# Altium schematic sheet ROCKCHIP_GPIO_NC PINS.SchDoc
size A4; SheetNumber: 26; SheetTotal: 27
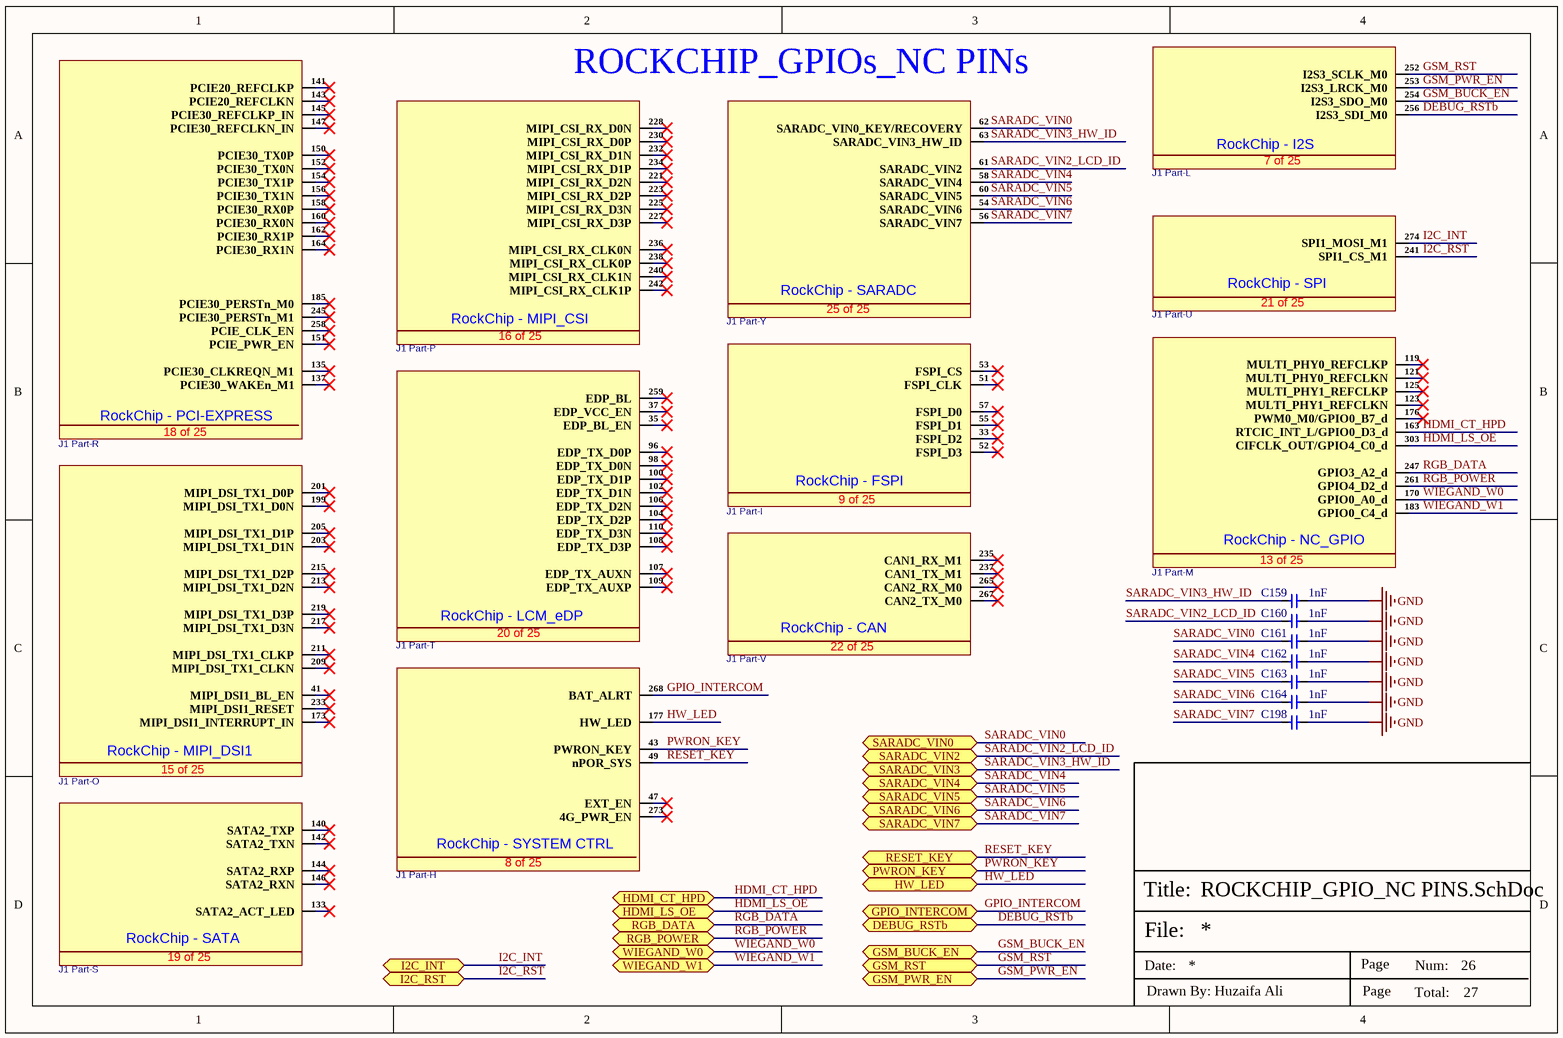
[diagram p0: ROCKCHIP_GPIO_NC PINS.SchDoc]

## Parts
C159  1nF  [Cap-0402]
C160  1nF  [Cap-0402]
C161  1nF  [Cap-0402]
C162  1nF  [Cap-0402]
C163  1nF  [Cap-0402]
C164  1nF  [Cap-0402]
C198  1nF  [Cap-0402]
J1_Part-  AS0B826-S78B-7H  [AS0B826-S78B-7H]  (value not drawn)  (parts H,I,L,M,O,P,R,S,T,U,V,Y of 25)

## Ports
DEBUG_RSTb (bidir, see TOP SHEET[6C], DEBUG_UART_INTERFACE[3D]), GPIO_INTERCOM (bidir, see TOP SHEET[5D], PUSH BUTTONs_INTERFACE[3C]), GSM_BUCK_EN (bidir, see TOP SHEET[6C], LINEAR_VOLTAGE_REG[3D], POWER SECTION[3D]), GSM_PWR_EN (bidir, see TOP SHEET[6C], DUAL_SIM_INTERFACE[2D]), GSM_RST (bidir, see TOP SHEET[6C], DUAL_SIM_INTERFACE[2D]), HDMI_CT_HPD (bidir, see TOP SHEET[6C], HDMI_INTERFACE[3D]), HDMI_LS_OE (bidir, see TOP SHEET[6C], HDMI_INTERFACE[3D]), HW_LED (bidir, see TOP SHEET[5C], ROCKCHIP_SYSTEM_CONTROL[3C]), I2C_INT (bidir, see TOP SHEET[5B], DIGITAL IO_RELAY_SHEET[5D]), I2C_RST (bidir, see TOP SHEET[5B], DIGITAL IO_RELAY_SHEET[5D]), PWRON_KEY (bidir, see TOP SHEET[5C], ROCKCHIP_SYSTEM_CONTROL[3C]), RESET_KEY (bidir, see TOP SHEET[5C], ROCKCHIP_SYSTEM_CONTROL[3C]), RGB_DATA (bidir, see TOP SHEET[5C], RGB_LEDs_INTERFACE[3D]), RGB_POWER (bidir, see TOP SHEET[5C], RGB_LEDs_INTERFACE[3D]), SARADC_VIN0 (bidir, see TOP SHEET[5D], PUSH BUTTONs_INTERFACE[3C]), SARADC_VIN2 (bidir, see TOP SHEET[5C], MIPI-DSI DISPLAY[3D], ROCKCHIP_SYSTEM_CONTROL[3C]), SARADC_VIN3 (bidir, see TOP SHEET[5C], ROCKCHIP_SYSTEM_CONTROL[3C]), SARADC_VIN4 (bidir, see TOP SHEET[5C], ROCKCHIP_SYSTEM_CONTROL[3C]), SARADC_VIN5 (bidir, see TOP SHEET[5C], ROCKCHIP_SYSTEM_CONTROL[3C]), SARADC_VIN6 (bidir, see TOP SHEET[5C], ROCKCHIP_SYSTEM_CONTROL[3C]), SARADC_VIN7 (bidir, see TOP SHEET[5C], ROCKCHIP_SYSTEM_CONTROL[3C]), WIEGAND_W0 (bidir, see TOP SHEET[6B], WIEGAND_INTERFACE[3D]), WIEGAND_W1 (bidir, see TOP SHEET[6B], WIEGAND_INTERFACE[3D])

## Nets
GND: C159.2 C160.2 C161.2 C162.2 C163.2 C164.2 C198.2
DEBUG_RSTb: J1_Part-.256(I2S3_SDI_M0) ; port DEBUG_RSTb
GPIO_INTERCOM: J1_Part-.268(BAT_ALRT) ; port GPIO_INTERCOM
GSM_BUCK_EN: J1_Part-.254(I2S3_SDO_M0) ; port GSM_BUCK_EN
GSM_PWR_EN: J1_Part-.253(I2S3_LRCK_M0) ; port GSM_PWR_EN
GSM_RST: J1_Part-.252(I2S3_SCLK_M0) ; port GSM_RST
HDMI_CT_HPD: J1_Part-.163(RTCIC_INT_L/GPIO0_D3_d) ; port HDMI_CT_HPD
HDMI_LS_OE: J1_Part-.303(CIFCLK_OUT/GPIO4_C0_d) ; port HDMI_LS_OE
HW_LED: J1_Part-.177(HW_LED) ; port HW_LED
I2C_INT: J1_Part-.274(SPI1_MOSI_M1) ; port I2C_INT
I2C_RST: J1_Part-.241(SPI1_CS_M1) ; port I2C_RST
PWRON_KEY: J1_Part-.43(PWRON_KEY) ; port PWRON_KEY
RESET_KEY: J1_Part-.49(nPOR_SYS) ; port RESET_KEY
RGB_DATA: J1_Part-.247(GPIO3_A2_d) ; port RGB_DATA
RGB_POWER: J1_Part-.261(GPIO4_D2_d) ; port RGB_POWER
SARADC_VIN0: C161.1 J1_Part-.62(SARADC_VIN0_KEY/RECOVERY) ; port SARADC_VIN0
SARADC_VIN2_LCD_ID: C160.1 J1_Part-.61(SARADC_VIN2) ; port SARADC_VIN2
SARADC_VIN3_HW_ID: C159.1 J1_Part-.63(SARADC_VIN3_HW_ID) ; port SARADC_VIN3
SARADC_VIN4: C162.1 J1_Part-.58(SARADC_VIN4) ; port SARADC_VIN4
SARADC_VIN5: C163.1 J1_Part-.60(SARADC_VIN5) ; port SARADC_VIN5
SARADC_VIN6: C164.1 J1_Part-.54(SARADC_VIN6) ; port SARADC_VIN6
SARADC_VIN7: C198.1 J1_Part-.56(SARADC_VIN7) ; port SARADC_VIN7
WIEGAND_W0: J1_Part-.170(GPIO0_A0_d) ; port WIEGAND_W0
WIEGAND_W1: J1_Part-.183(GPIO0_C4_d) ; port WIEGAND_W1

Not connected (* = marked no-connect by the designer): J1_Part- 33(FSPI_D2)* 35(EDP_BL_EN)* 37(EDP_VCC_EN)* 41(MIPI_DSI1_BL_EN)* 47(EXT_EN)* 51(FSPI_CLK)* 52(FSPI_D3)* 53(FSPI_CS)* 55(FSPI_D1)* 57(FSPI_D0)* 96(EDP_TX_D0P)* 98(EDP_TX_D0N)* 100(EDP_TX_D1P)* 102(EDP_TX_D1N)* 104(EDP_TX_D2P)* 106(EDP_TX_D2N)* 107(EDP_TX_AUXN)* 108(EDP_TX_D3P)* 109(EDP_TX_AUXP)* 110(EDP_TX_D3N)* 119(MULTI_PHY0_REFCLKP)* 121(MULTI_PHY0_REFCLKN)* 123(MULTI_PHY1_REFCLKN)* 125(MULTI_PHY1_REFCLKP)* 133(SATA2_ACT_LED)* 135(PCIE30_CLKREQN_M1)* 137(PCIE30_WAKEn_M1)* 140(SATA2_TXP)* 141(PCIE20_REFCLKP)* 142(SATA2_TXN)* 143(PCIE20_REFCLKN)* 144(SATA2_RXP)* 145(PCIE30_REFCLKP_IN)* 146(SATA2_RXN)* 147(PCIE30_REFCLKN_IN)* 150(PCIE30_TX0P)* 151(PCIE_PWR_EN)* 152(PCIE30_TX0N)* 154(PCIE30_TX1P)* 156(PCIE30_TX1N)* 158(PCIE30_RX0P)* 160(PCIE30_RX0N)* 162(PCIE30_RX1P)* 164(PCIE30_RX1N)* 173(MIPI_DSI1_INTERRUPT_IN)* 176(PWM0_M0/GPIO0_B7_d)* 185(PCIE30_PERSTn_M0)* 199(MIPI_DSI_TX1_D0N)* 201(MIPI_DSI_TX1_D0P)* 203(MIPI_DSI_TX1_D1N)* 205(MIPI_DSI_TX1_D1P)* 209(MIPI_DSI_TX1_CLKN)* 211(MIPI_DSI_TX1_CLKP)* 213(MIPI_DSI_TX1_D2N)* 215(MIPI_DSI_TX1_D2P)* 217(MIPI_DSI_TX1_D3N)* 219(MIPI_DSI_TX1_D3P)* 221(MIPI_CSI_RX_D2N)* 223(MIPI_CSI_RX_D2P)* 225(MIPI_CSI_RX_D3N)* 227(MIPI_CSI_RX_D3P)* 228(MIPI_CSI_RX_D0N)* 230(MIPI_CSI_RX_D0P)* 232(MIPI_CSI_RX_D1N)* 233(MIPI_DSI1_RESET)* 234(MIPI_CSI_RX_D1P)* 235(CAN1_RX_M1)* 236(MIPI_CSI_RX_CLK0N)* 237(CAN1_TX_M1)* 238(MIPI_CSI_RX_CLK0P)* 240(MIPI_CSI_RX_CLK1N)* 242(MIPI_CSI_RX_CLK1P)* 245(PCIE30_PERSTn_M1)* 258(PCIE_CLK_EN)* 259(EDP_BL)* 265(CAN2_RX_M0)* 267(CAN2_TX_M0)* 273(4G_PWR_EN)*

## Notes on the sheet
- (near J1_Part-) ROCKCHIP_GPIOs_NC PINs
- File:
- Title:
- Date:
- Page
- Num:
- Total:
- Drawn By: Huzaifa Ali
- (in symbol AS0B826-S78B-7H, part H) RockChip - SYSTEM CTRL; 8 of 25
- (in symbol AS0B826-S78B-7H, part I) RockChip - FSPI; 9 of 25
- (in symbol AS0B826-S78B-7H, part L) RockChip - I2S; 7 of 25
- (in symbol AS0B826-S78B-7H, part M) RockChip - NC_GPIO; 13 of 25
- (in symbol AS0B826-S78B-7H, part O) RockChip - MIPI_DSI1; 15 of 25
- (in symbol AS0B826-S78B-7H, part P) RockChip - MIPI_CSI; 16 of 25
- (in symbol AS0B826-S78B-7H, part R) RockChip - PCI-EXPRESS; 18 of 25
- (in symbol AS0B826-S78B-7H, part S) RockChip - SATA; 19 of 25
- (in symbol AS0B826-S78B-7H, part T) RockChip - LCM_eDP; 20 of 25
- (in symbol AS0B826-S78B-7H, part U) RockChip - SPI; 21 of 25
- (in symbol AS0B826-S78B-7H, part V) RockChip - CAN; 22 of 25
- (in symbol AS0B826-S78B-7H, part Y) RockChip - SARADC; 25 of 25

## Library data of the parts
C159-C164 C198 = CC0402KRX7R8BB102: CAP CER 1000PF 25V X7R 0402; Manufacturer: Yageo; Tolerance: 10%; Dissipation Factor: 2.5%; Insulation Resistance: 10GR; Item Type: Capacitor; Supplier 1: Arrow Electronics; Manufacturer Part Number: CC0402KRX7R8BB102; RoHS: Yes; Category: Ceramic Capacitors; Stock 1: 370000; Pricing 1: 1=0.00230, 10000=0.00230, 100001=0.00190 (USD); Mount: Surface Mount; Case/Package: 0402; Number of Pins: 2; Case Code (Imperial): 0402; Case Code (Metric): 1005; Min Operating Temperature: -55°C; Max Operating Temperature: 125°C; Capacitance: 1nF; Packaging: Tape and Reel; Voltage Rating: 25V; Dielectric: X7R; Termination: SMD/SMT; Voltage Rating (DC): 25V; Series: CC; Length: 1mm; Width: 0.02inch; Thickness: 0.022inch; Depth: 0.5mm; Radiation Hardening: No; Lead Free: Lead Free; Halogen Free: Halogen Free; RoHS Compliant: Yes; ComponentLink1URL: https://datasheet.ciiva.com/26862/getdatasheetpartid-639817-26862638.pdf?src-supplier=Verical; ComponentLink1Description: https://datasheet.ciiva.com/26862/getdatasheetpartid-639817-26862638.pdf?src-supplier=Verical; ComponentLink2URL: https://datasheet.ciiva.com/5425/upy-gp-np0-16v-to-50v-8-3714-5425527.pdf?src-supplier=Mouser; ComponentLink2Description: https://datasheet.ciiva.com/5425/upy-gp-np0-16v-to-50v-8-3714-5425527.pdf?src-supplier=Mouser; Supplier Part Number 1: CC0402KRX7R8BB102; LCSC Part Number: C541372
J1_Part- = AS0B826-S78B-7H: SMD,P=0.5mm,Surface Mount，Right Angle; Manufacturer: FOXCONN; Item Type: Card Edge Connectors; Supplier: LCSC; Manufacturer Part Number: AS0B826-S78B-7H; RoHS: No; Stock: 4979; Pricing: 1=9.21, 10=8.287, 25=7.8064, 50=7.6064, 100=7.4062 (USD); LCSC Part Number: C426232